# Altium schematic sheet Top Sheet_Power System.SchDoc
size B; Organization: Altium Limited; Address1: L3, 12a Rodborough Rd; Address2: Frenchs Forest; Address3: NSW; Address4: Australia 2086; SheetNumber: 1; SheetTotal: 1
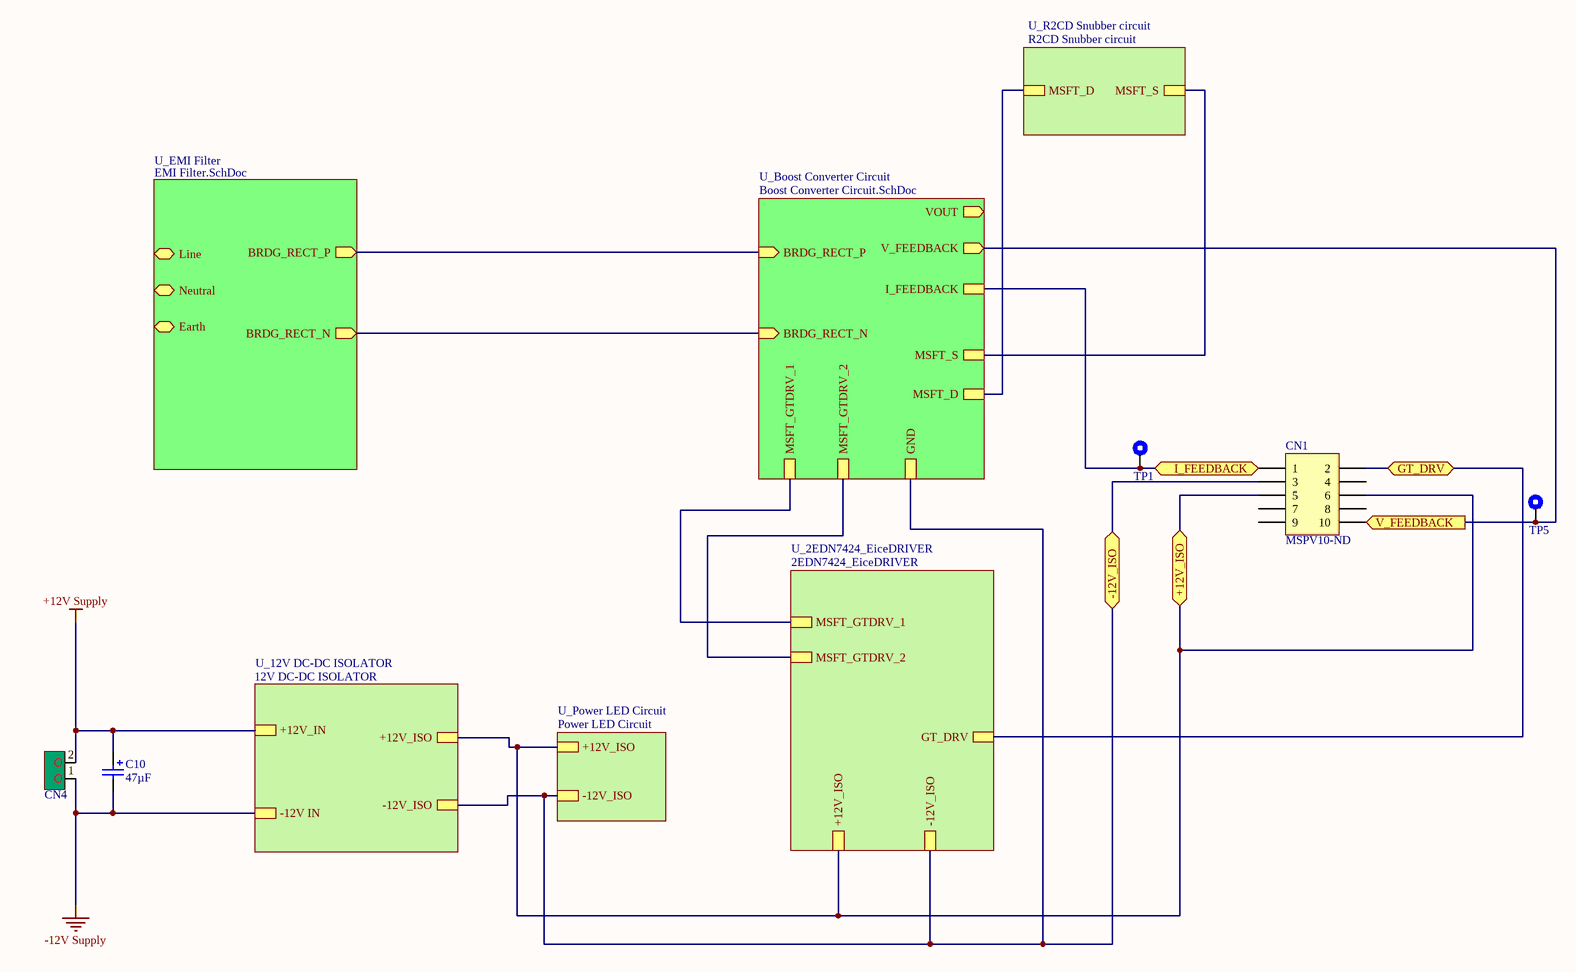
[diagram p0: Top Sheet_Power System.SchDoc]

## Parts
C10  Capacitance: 47µF  [CAPALUM47U]  (hidden comment: ECA-1VM470)
CN1  MSPV10-ND  [MSV10-ND]
CN4  1935776  [CONN_1935776]  (value not drawn)
TP1  5006  [Test Point]  (value not drawn)
TP5  5006  [Test Point]  (value not drawn)

## Sub-sheets
U_2EDN7424_EiceDRIVER = 2EDN7424_EiceDRIVER: MSFT_GTDRV_1, MSFT_GTDRV_2, GT_DRV, -12V_ISO, +12V_ISO
U_12V DC-DC ISOLATOR = 12V DC-DC ISOLATOR: -12V_ISO, +12V_ISO, -12V IN, +12V_IN
U_Boost Converter Circuit = Boost Converter Circuit.SchDoc: BRDG_RECT_P (in), VOUT (out), BRDG_RECT_N (in), V_FEEDBACK (out), I_FEEDBACK, GND, MSFT_GTDRV_1, MSFT_GTDRV_2, MSFT_D, MSFT_S
U_EMI Filter = EMI Filter.SchDoc: BRDG_RECT_P (out), BRDG_RECT_N (out), Line (bidir), Neutral (bidir), Earth (bidir)
U_Power LED Circuit = Power LED Circuit: -12V_ISO, +12V_ISO
U_R2CD Snubber circuit = R2CD Snubber circuit: MSFT_D, MSFT_S

## Ports
+12V_ISO, -12V_ISO, GT_DRV, I_FEEDBACK, V_FEEDBACK (out)

## Nets
+12V Supply: C10.1 CN4.2 ; sheet U_12V DC-DC ISOLATOR/+12V_IN
-12V Supply: C10.2 CN4.1 ; sheet U_12V DC-DC ISOLATOR/-12V IN
+12V_ISO: CN1.5 CN1.6 ; port +12V_ISO, sheet U_Power LED Circuit/+12V_ISO, sheet U_12V DC-DC ISOLATOR/+12V_ISO, sheet U_2EDN7424_EiceDRIVER/+12V_ISO
-12V_ISO: CN1.3 ; port -12V_ISO, sheet U_Power LED Circuit/-12V_ISO, sheet U_12V DC-DC ISOLATOR/-12V_ISO, sheet U_2EDN7424_EiceDRIVER/-12V_ISO, sheet U_Boost Converter Circuit/GND
GT_DRV: CN1.2 ; port GT_DRV, sheet U_2EDN7424_EiceDRIVER/GT_DRV
I_FEEDBACK: CN1.1 TP1.1 ; port I_FEEDBACK, sheet U_Boost Converter Circuit/I_FEEDBACK
V_FEEDBACK: CN1.10 TP5.1 ; port V_FEEDBACK, sheet U_Boost Converter Circuit/V_FEEDBACK
(unnamed): sheet U_EMI Filter/BRDG_RECT_P, sheet U_Boost Converter Circuit/BRDG_RECT_P
(unnamed): sheet U_EMI Filter/BRDG_RECT_N, sheet U_Boost Converter Circuit/BRDG_RECT_N
(unnamed): sheet U_2EDN7424_EiceDRIVER/MSFT_GTDRV_1, sheet U_Boost Converter Circuit/MSFT_GTDRV_1
(unnamed): sheet U_2EDN7424_EiceDRIVER/MSFT_GTDRV_2, sheet U_Boost Converter Circuit/MSFT_GTDRV_2
(unnamed): sheet U_Boost Converter Circuit/MSFT_D, sheet U_R2CD Snubber circuit/MSFT_D
(unnamed): sheet U_Boost Converter Circuit/MSFT_S, sheet U_R2CD Snubber circuit/MSFT_S

Not connected (* = marked no-connect by the designer): CN1 4 7 8 9

## Notes on the sheet
- Title:
- Size:
- B
- Document Number:
- Revision:
- Designer:
- Approval Date:
- Start Date:
- MM/DD/YY
- --/--/--
- Sheet:
- of
- Approver:
- CONFIDENTIAL
- Project Name/Number:

## Library data of the parts
C10 = ECA-1VM470: CAP ALUM 47UF 20% 35V RADIAL; Manufacturer 1: Panasonic Electronic Components; Category 1: Capacitors; Lifetime @ Temp.: 2000 Hrs @ 85°C; Polarization: Polar; Ripple Current: 130mA @ 120Hz; Supplier 1: Digi-Key; Supplier Part Number 1: P5164-ND; Manufacturer Part Number 1: ECA-1VM470; RoHS 1: RoHS Compliant; Description 1: CAP ALUM 47UF 20% 35V RADIAL; Stock 1: 32051; Pricing 1: 1=0.19, 10=0.131, 25=0.0964, 50=0.0788, 100=0.0665, 250=0.05424, 500=0.0455, 1000=0.04025, 5000=0.035 (USD); Packaging: Bulk; Part Status: Active; Tolerance: ±20%; Voltage Rating: 35V; ESR (Equivalent Series Resistance): -; Operating Temperature: -40°C ~ 85°C; Applications: General Purpose; Impedance: -; Lead Spacing: 0.079" (2.00mm); Size / Dimension: 0.197" Dia (5.00mm); Height - Seated (Max): 0.472" (12.00mm); Surface Mount Land Size: -; Mounting Type: Through Hole; Package / Case: Radial, Can; ComponentLink1URL: http://industrial.panasonic.com/www-cgi/jvcr13pz.cgi?E+PZ+3+ABA0012+ECA1VM470+7+WW; ComponentLink1Description: http://industrial.panasonic.com/www-cgi/jvcr13pz.cgi?E+PZ+3+ABA0012+ECA1VM470+7+WW
CN1 = MSPV10-ND: CONN SOCKET PCB VERT 10POS .1"; Manufacturer: 3M; Manufacturer Part Number: 8510-4500PL; Connector Type: Receptacle; Style: Board to Board or Cable; Number of Positions: 10; Number of Positions Loaded: All; Pitch - Mating: 0.100" (2.54mm); Contact Length - Post: 0.110" (2.79mm); Material Flammability Rating: UL94 V-0; Current Rating: 1A; Voltage Rating: 1000V; Supplier 1: Digi-Key; RoHS: RoHS Compliant; Category: Connectors, Interconnects; Stock 1: 448; Pricing 1: 1=3.03, 10=2.904, 100=2.42, 500=2.057, 1000=1.7545, 5000=1.573 (USD); Packaging: Bulk; Part Status: Active; Contact Type: Female Socket; Number of Rows: 2; Row Spacing - Mating: 0.100" (2.54mm); Mounting Type: Through Hole; Termination: Kinked Pin, Solder; Fastening Type: Push-Pull; Contact Finish - Mating: Gold; Contact Finish Thickness - Mating: 12µin (0.30µm); Insulation Color: Gray; Insulation Height: 0.425" (10.80mm); Operating Temperature: -55°C ~ 105°C; Contact Finish - Post: Gold; Mated Stacking Heights: -; Ingress Protection: -; Features: Polarizing Key; Applications: -; Insulation Material: Polybutylene Terephthalate (PBT), Glass Filled; Contact Shape: Square; Contact Material: Copper Alloy; Contact Finish Thickness - Post: Flash; ComponentLink1URL: http://multimedia.3m.com/mws/media/22252O/3mtm-100-in-plr-bmskt-100x-100ctrbmp-strt-sldr-tls-ts0413.pdf; ComponentLink1Description: http://multimedia.3m.com/mws/media/22252O/3mtm-100-in-plr-bmskt-100x-100ctrbmp-strt-sldr-tls-ts0413.pdf; Supplier Part Number 1: MSPV10-ND
CN4 = 1935776: CONN TERM BLOCK 2POS 5.0MM; Manufacturer 1: Phoenix Contact; Category 1: Connectors, Interconnects; Number of Levels: 1; Positions Per Level: 2; Pitch: 0.197" (5.00mm); Mating Orientation: Horizontal with Board; Current: 20A; Voltage: 300V; Wire Gauge: 12-20 AWG; Wire Termination: Screw; Torque - Screw: 0.45-0.5 Nm (3.9-4.4 Lb-In); Screw Thread: M3; Supplier 1: Digi-Key; Supplier Part Number 1: 277-6405-ND; Manufacturer Part Number 1: 1935776; RoHS 1: RoHS Compliant; Description 1: CONN TERM BLOCK 2POS 5.0MM; Stock 1: 5591; Pricing 1: 1=0.43, 10=0.411, 50=0.3928, 100=0.382, 250=0.357, 500=0.32844, 1000=0.2975 (USD); Packaging: Bulk; Part Status: Active; Mounting Type: Through Hole; Features: Interlocking (Side); Color: Green; Operating Temperature: -; Housing Material: Polyamide (PA), Nylon; Contact Material - Plating: -; Clamp Material - Plating: -; Screw Material - Plating: -; ComponentLink1URL: http://media.digikey.com/pdf/Data%20Sheets/Phoenix%20Contact%20PDFs/COMBICON%20Compact%20PT2,5.pdf; ComponentLink1Description: http://media.digikey.com/pdf/Data%20Sheets/Phoenix%20Contact%20PDFs/COMBICON%20Compact%20PT2,5.pdf
TP1 TP5 = 5006: TEST POINT PC COMPACT .063"D BLK; Manufacturer 1: Keystone Electronics; Category 1: Test and Measurement; Plating: Silver; Material - Insulation: Nylon 46, UL 94V-0; Material - Body: Phosphor Bronze; Supplier 1: Digi-Key; Supplier Part Number 1: 36-5006-ND; Manufacturer Part Number 1: 5006; RoHS 1: RoHS Compliant; Description 1: TEST POINT PC COMPACT .063"D BLK; Stock 1: 199444; Pricing 1: 1=0.37, 10=0.316, 50=0.2298, 100=0.2209, 250=0.19832, 500=0.18932, 1000=0.1616, 2500=0.14424, 5000=0.13523 (USD); Packaging: Bulk; Part Status: Active; Type: PC Test Point, Compact; Mounting Type: 0.063" (1.60mm) Hole Diameter; Color: Black; Size / Dimension: 0.125" Dia x 0.220" L (3.18mm x 5.59mm); ComponentLink1URL: http://www.keyelco.com/product-pdf.cfm?p=1314; ComponentLink1Description: http://www.keyelco.com/product-pdf.cfm?p=1314